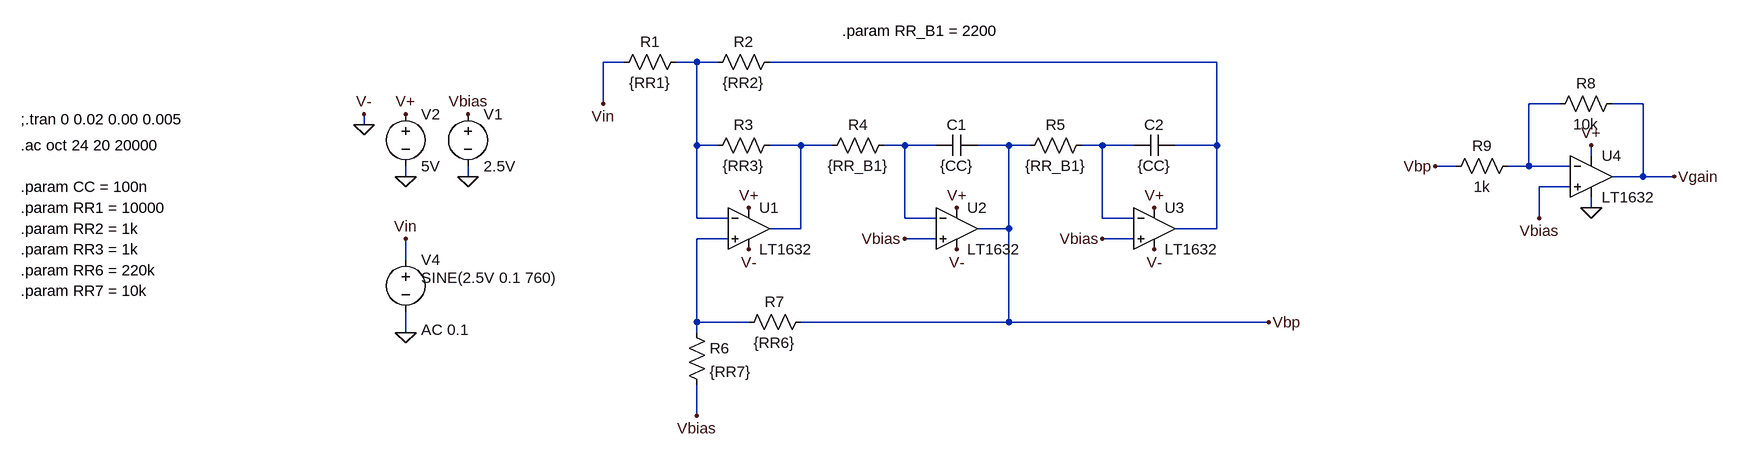
[diagram p0: schematic AnalogStateVar_AC_SingleSupply.asc]
AnalogStateVar_AC_SingleSupply.asc, the LTspice schematic file:
Version 4
SHEET 1 1800 3212
WIRE -432 368 -464 368
WIRE -320 368 -352 368
WIRE -288 368 -320 368
WIRE 480 368 -208 368
WIRE -464 432 -464 368
WIRE 1008 432 960 432
WIRE 1136 432 1088 432
WIRE -832 464 -832 448
WIRE -320 496 -320 368
WIRE -288 496 -320 496
WIRE -160 496 -208 496
WIRE -112 496 -160 496
WIRE 0 496 -32 496
WIRE 48 496 0 496
WIRE 160 496 112 496
WIRE 192 496 160 496
WIRE 304 496 272 496
WIRE 352 496 304 496
WIRE 480 496 480 368
WIRE 480 496 416 496
WIRE 1056 512 1056 496
WIRE 848 528 816 528
WIRE 960 528 960 432
WIRE 960 528 928 528
WIRE 1024 528 960 528
WIRE -768 544 -768 528
WIRE -672 544 -672 528
WIRE 1136 544 1136 432
WIRE 1136 544 1088 544
WIRE 1184 544 1136 544
WIRE 1024 560 976 560
WIRE 1056 592 1056 576
WIRE -320 608 -320 496
WIRE -272 608 -320 608
WIRE 0 608 0 496
WIRE 48 608 0 608
WIRE 304 608 304 496
WIRE 352 608 304 608
WIRE 976 608 976 560
WIRE -160 624 -160 496
WIRE -160 624 -208 624
WIRE 160 624 160 496
WIRE 160 624 112 624
WIRE 480 624 480 496
WIRE 480 624 416 624
WIRE -272 640 -320 640
WIRE 48 640 0 640
WIRE 352 640 304 640
WIRE -768 672 -768 640
WIRE -320 768 -320 640
WIRE -240 768 -320 768
WIRE 160 768 160 624
WIRE 160 768 -160 768
WIRE 560 768 160 768
WIRE -768 784 -768 752
WIRE -320 784 -320 768
WIRE -320 912 -320 864
FLAG -832 464 0
FLAG -768 544 0
FLAG -768 448 V+
FLAG -768 784 0
FLAG -768 640 Vin
FLAG -240 592 V+
FLAG 80 592 V+
FLAG 384 592 V+
FLAG -240 656 V-
FLAG 80 656 V-
FLAG 384 656 V-
FLAG 304 640 Vbias
FLAG -832 448 V-
FLAG 0 640 Vbias
FLAG -320 912 Vbias
FLAG 1056 592 0
FLAG 1056 496 V+
FLAG 1184 544 Vgain
FLAG -464 432 Vin
FLAG 560 768 Vbp
FLAG 976 608 Vbias
FLAG 816 528 Vbp
FLAG -672 544 0
FLAG -672 448 Vbias
SYMBOL voltage -768 432 R0
SYMATTR InstName V2
SYMATTR Value 5V
SYMBOL voltage -768 656 R0
WINDOW 123 24 124 Left 2
WINDOW 39 0 0 Left 0
WINDOW 3 24 44 Left 2
SYMATTR Value2 AC 0.1
SYMATTR Value SINE(2.5V 0.1 760)
SYMATTR InstName V4
SYMBOL Opamps\\LT1632 -240 560 R0
SYMATTR InstName U1
SYMBOL Opamps\\LT1632 80 560 R0
SYMATTR InstName U2
SYMBOL Opamps\\LT1632 384 560 R0
SYMATTR InstName U3
SYMBOL res -192 480 R90
WINDOW 0 0 56 VBottom 2
WINDOW 3 32 56 VTop 2
SYMATTR InstName R3
SYMATTR Value {RR3}
SYMBOL res -16 480 R90
WINDOW 0 0 56 VBottom 2
WINDOW 3 32 56 VTop 2
SYMATTR InstName R4
SYMATTR Value {RR_B1}
SYMBOL cap 112 480 R90
WINDOW 0 0 32 VBottom 2
WINDOW 3 32 32 VTop 2
SYMATTR InstName C1
SYMATTR Value {CC}
SYMBOL res 288 480 R90
WINDOW 0 0 56 VBottom 2
WINDOW 3 32 56 VTop 2
SYMATTR InstName R5
SYMATTR Value {RR_B1}
SYMBOL cap 416 480 R90
WINDOW 0 0 32 VBottom 2
WINDOW 3 32 32 VTop 2
SYMATTR InstName C2
SYMATTR Value {CC}
SYMBOL res -336 352 R90
WINDOW 0 0 56 VBottom 2
WINDOW 3 32 56 VTop 2
SYMATTR InstName R1
SYMATTR Value {RR1}
SYMBOL res -192 352 R90
WINDOW 0 0 56 VBottom 2
WINDOW 3 32 56 VTop 2
SYMATTR InstName R2
SYMATTR Value {RR2}
SYMBOL Opamps\\LT1632 1056 480 R0
SYMATTR InstName U4
SYMBOL res 1104 416 R90
WINDOW 0 0 56 VBottom 2
WINDOW 3 32 56 VTop 2
SYMATTR InstName R8
SYMATTR Value 10k
SYMBOL res 944 512 R90
WINDOW 0 0 56 VBottom 2
WINDOW 3 32 56 VTop 2
SYMATTR InstName R9
SYMATTR Value 1k
SYMBOL voltage -672 432 R0
WINDOW 123 0 0 Left 0
WINDOW 39 0 0 Left 0
SYMATTR InstName V1
SYMATTR Value 2.5V
SYMBOL res -336 768 R0
SYMATTR InstName R6
SYMATTR Value {RR7}
SYMBOL res -144 752 R90
WINDOW 0 0 56 VBottom 2
WINDOW 3 32 56 VTop 2
SYMATTR InstName R7
SYMATTR Value {RR6}
TEXT -1360 496 Left 2 !.ac oct 24 20 20000
TEXT -1360 560 Left 2 !.param CC = 100n
TEXT -1360 592 Left 2 !.param RR1 = 10000
TEXT -1360 624 Left 2 !.param RR2 = 1k
TEXT -1360 656 Left 2 !.param RR3 = 1k
TEXT -1360 688 Left 2 !.param RR6 = 220k
TEXT -96 320 Left 2 !.param RR_B1 = 2200
TEXT -1360 720 Left 2 !.param RR7 = 10k
TEXT -1360 456 Left 2 !;.tran 0 0.02 0.00 0.005

The netlist it stands for:
* AnalogStateVar_AC_SingleSupply.asc
V2 V+ 0 5V
V4 Vin 0 SINE(2.5V 0.1 760) AC 0.1
XU1 N007 N001 V+ 0 N004 LT1632  ; pins In+ In- V+ V- OUT
XU2 Vbias N005 V+ 0 Vbp LT1632  ; pins In+ In- V+ V- OUT
XU3 Vbias N006 V+ 0 N002 LT1632  ; pins In+ In- V+ V- OUT
R3 N004 N001 {RR3}
R4 N005 N004 {RR_B1}
C1 Vbp N005 {CC}
R5 N006 Vbp {RR_B1}
C2 N002 N006 {CC}
R1 N001 Vin {RR1}
R2 N002 N001 {RR2}
XU4 Vbias N003 V+ 0 Vgain LT1632  ; pins In+ In- V+ V- OUT
R8 Vgain N003 10k
R9 N003 Vbp 1k
V1 Vbias 0 2.5V
R6 N007 Vbias {RR7}
R7 Vbp N007 {RR6}
.ac oct 24 20 20000
.param CC = 100n
.param RR1 = 10000
.param RR2 = 1k
.param RR3 = 1k
.param RR6 = 220k
.param RR_B1 = 2200
.param RR7 = 10k
;.tran 0 0.02 0.00 0.005
.lib LTC.lib
.backanno
.end